# EAGLE design acs (EAGLE 7.2.0)
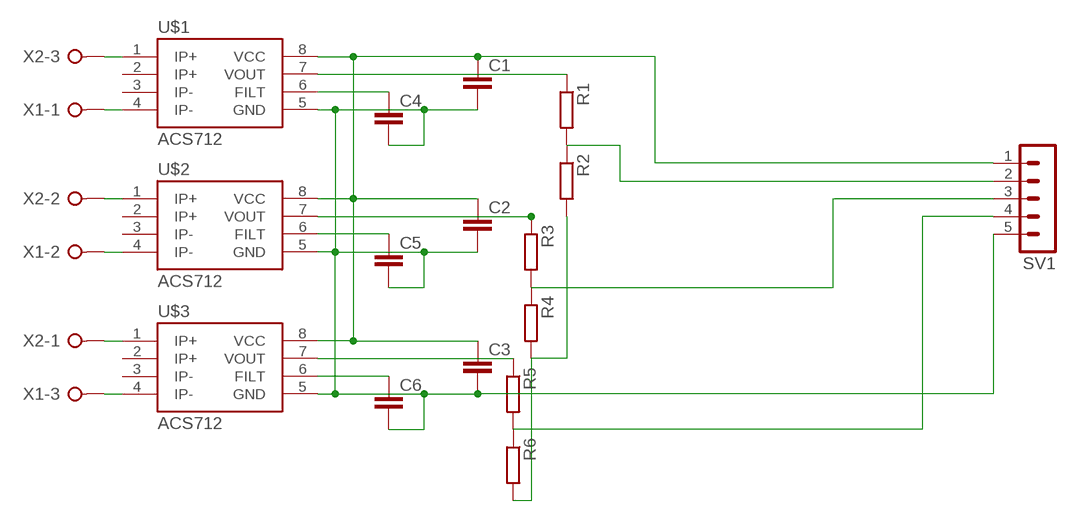
[diagram p0: schematic, sheet 1]

## Parts
C1  C-EUC0603  [C0603]
C2  C-EUC0603  [C0603]
C3  C-EUC0603  [C0603]
C4  C-EUC0603  [C0603]
C5  C-EUC0603  [C0603]
C6  C-EUC0603  [C0603]
R1  R-EU_R0603  [R0603]
R2  R-EU_R0603  [R0603]
R3  R-EU_R0603  [R0603]
R4  R-EU_R0603  [R0603]
R5  R-EU_R0603  [R0603]
R6  R-EU_R0603  [R0603]
SV1  MA05-1  [MA05-1]
U$1  ACS712  [SO08]
U$2  ACS712  [SO08]
U$3  ACS712  [SO08]
X1  W237-03P  [W237-133]
X2  W237-03P  [W237-133]

## Nets
N$1: U$1.4(IP-) X1.1
N$2: U$1.1(IP+) X2.3
N$3: U$2.4(IP-) X1.2
N$4: U$2.1(IP+) X2.2
N$5: U$3.1(IP+) X2.1
N$6: U$3.4(IP-) X1.3
N$7: C1.1 C2.1 C3.1 SV1.1 U$1.8(VCC) U$2.8(VCC) U$3.8(VCC)
N$8: C1.2 C2.2 C3.2 C4.2 C5.2 C6.2 SV1.5 U$1.5(GND) U$2.5(GND) U$3.5(GND)
N$9: C4.1 U$1.6(FILT)
N$10: C5.1 U$2.6(FILT)
N$11: C6.1 U$3.6(FILT)
N$12: R1.2 R2.1 SV1.2
N$13: R1.1 U$1.7(VOUT)
N$14: R3.1 U$2.7(VOUT)
N$15: R5.1 U$3.7(VOUT)
N$16: R3.2 R4.1 SV1.3
N$17: R5.2 R6.1 SV1.4
N$18: R2.2 R4.2 R6.2
Unconnected: U$1.2(IP+) U$1.3(IP-) U$2.2(IP+) U$2.3(IP-) U$3.2(IP+) U$3.3(IP-)

## Library data of the parts
C1-C6 = rcl:C-EU: CAPACITOR, European symbol
R1-R6 = rcl:R-EU_: RESISTOR, European symbol
SV1 = con-lstb:MA05-1: PIN HEADER; OC_FARNELL: unknown; OC_NEWARK: unknown
U$1-U$3 = SparkFun-AnalogIC:ACS712: Hall-effect-based isolated linear current sensor
X1 X2 = con-wago-508:W237-03P: WAGO SREW CLAMP; OC_FARNELL: unknown; OC_NEWARK: unknown

## Board
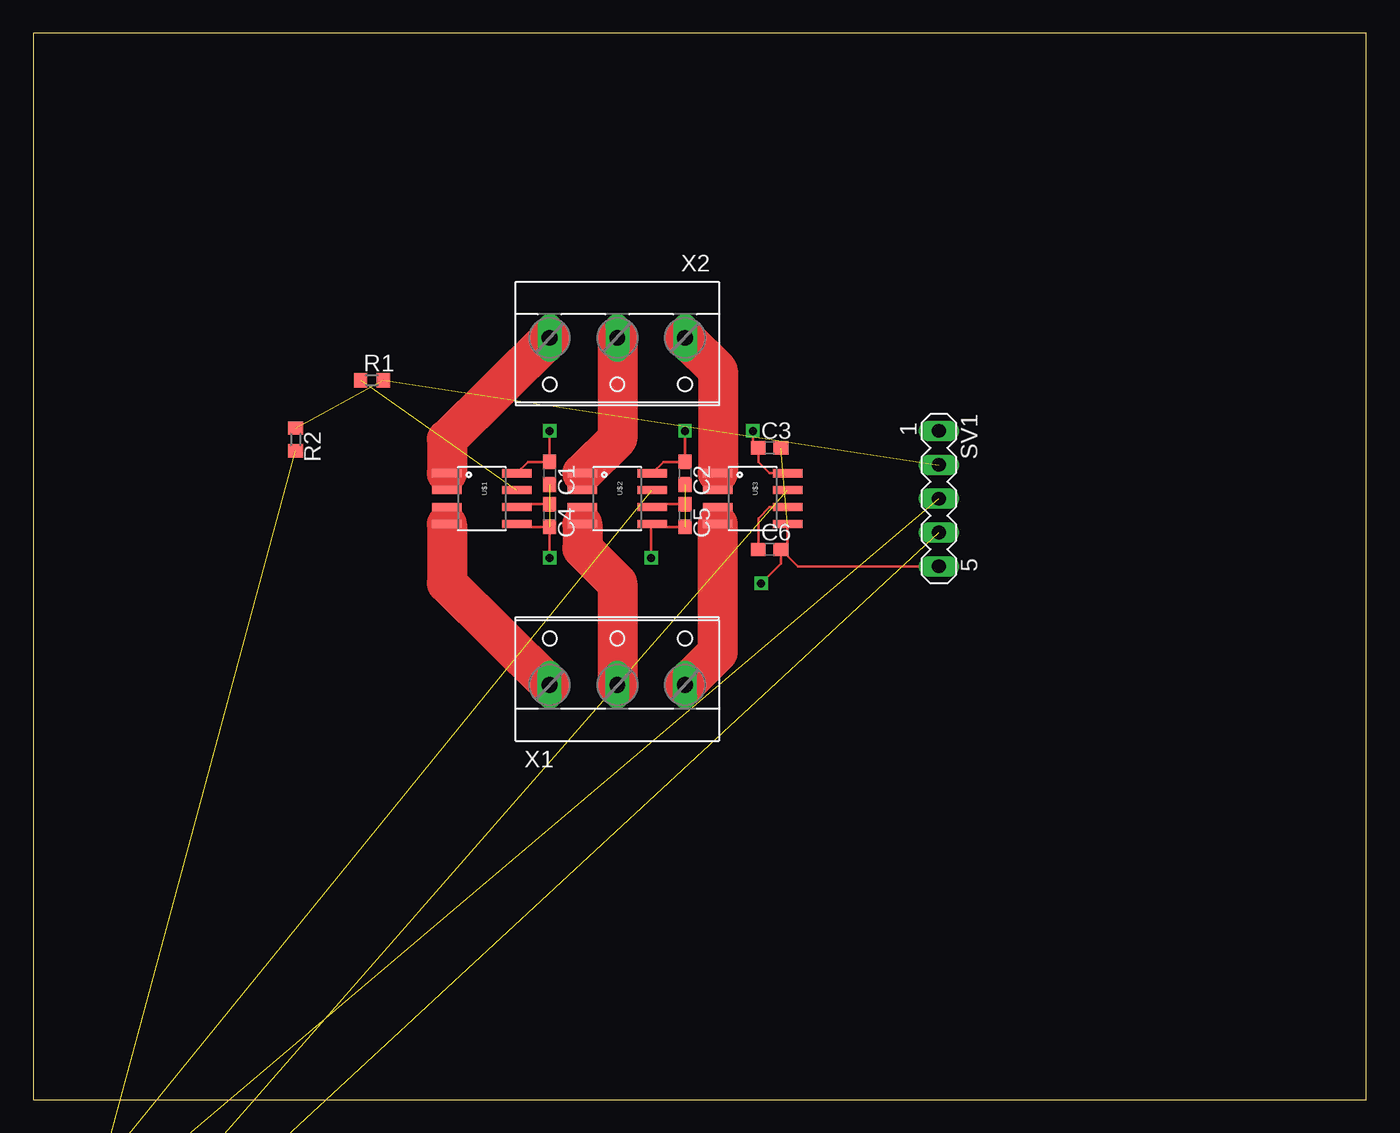
[diagram p1: board, top side]
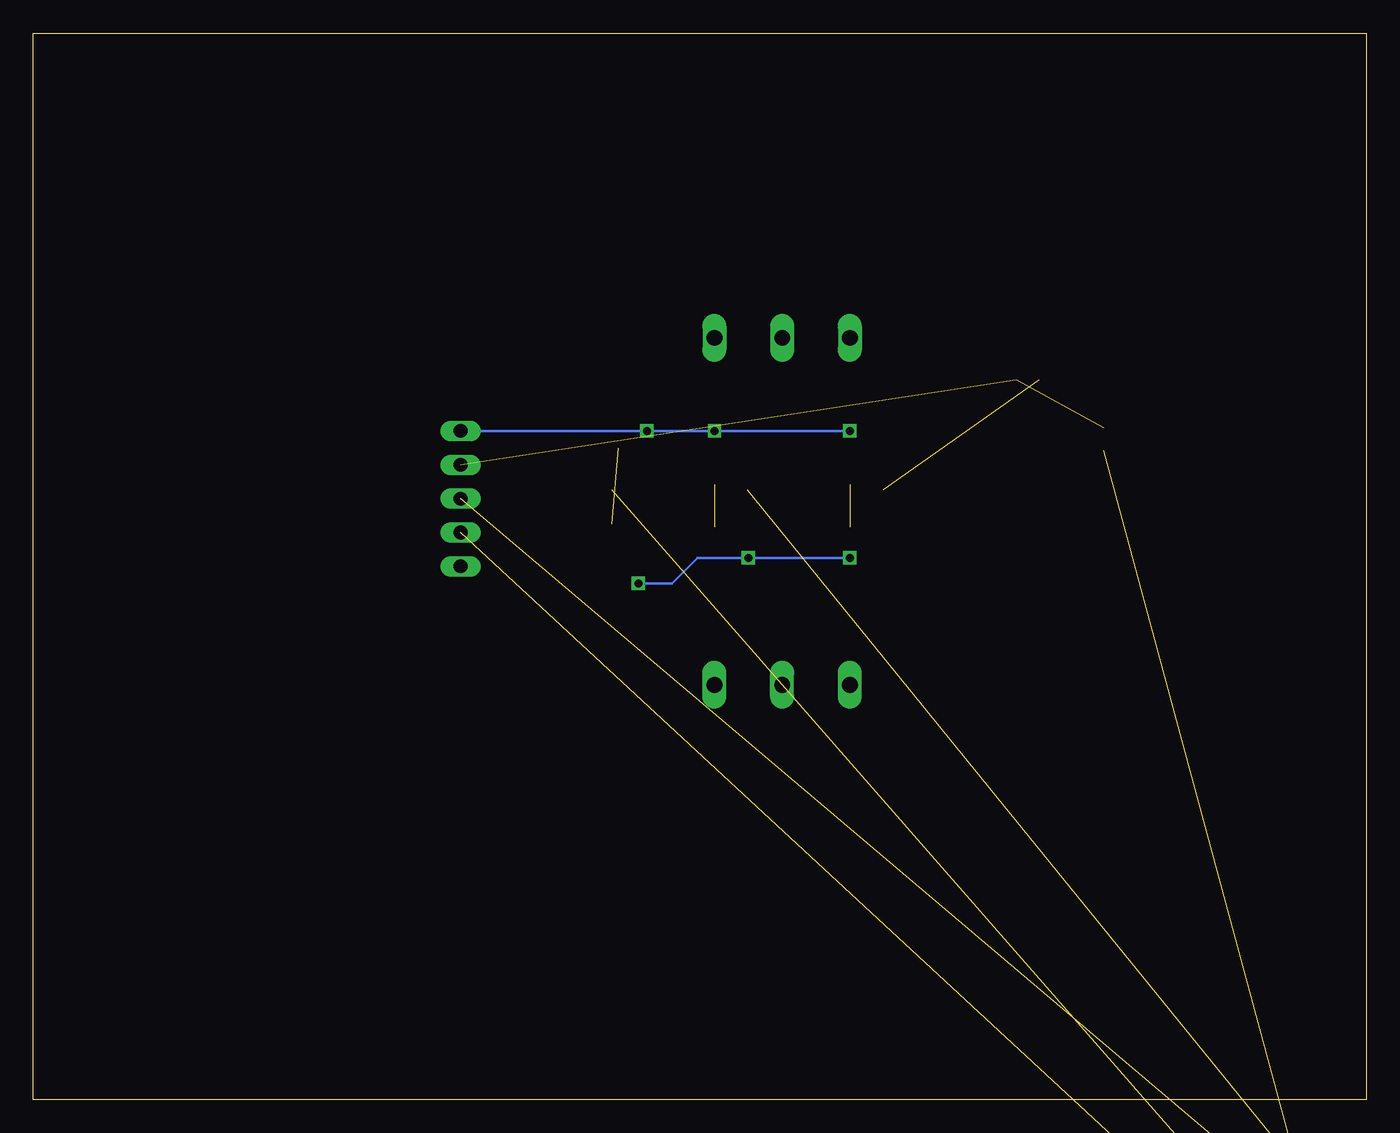
[diagram p2: board, bottom side, seen from below]

Size 100 x 80 mm. Coordinates in mm from the lower left corner, seen from the top.
Outline: 0,0 100,0 100,80 0,80 0,0
Copper layers (1*16): Top 0.035mm / dielectric 1.5mm / Bottom 0.035mm
Design rules "default": minimum track width 10mil, minimum drill 24mil, track to track 8mil, track to pad 8mil, pad to pad 8mil, via to via 8mil, smd to smd 8mil, copper to edge 40mil, drill to drill 8mil, minimum pad ring 10mil, minimum via ring 8mil, stop-mask expansion 4mil, vias tented up to drill 0mil, thermal gap 10mil

### Footprints (pad centres in the part's own frame; a part is rotated, then mirrored left to right if it is on the bottom)
C0603 = smd 1.1 x 1: 1 -0.85,0; 2 0.85,0
R0603 = smd 1 x 1.1: 1 -0.85,0; 2 0.85,0
MA05-1 = drill 1.016 long: 1 -5.08,0; 2 -2.54,0; 3 0,0; 4 2.54,0; 5 5.08,0
SO08 = smd 0.61 x 2.21: 1 -1.905,-2.616; 2 -0.635,-2.616; 3 0.635,-2.616; 4 1.905,-2.616; 5 1.905,2.616; 6 0.635,2.616; 7 -0.635,2.616; 8 -1.905,2.616
W237-133 = drill 1.194 long: 1 -5.08,-0.635; 2 0,-0.635; 3 5.08,-0.635

### Placement (x,y rotation side)
C1  38.73,46.99 270 top
C2  48.9,46.99 270 top
C3  55.24,48.9 0 top
C4  38.73,43.81 270 top
C5  48.9,43.81 270 top
C6  55.24,41.27 0 top
R1  25.4,53.98 0 top
R2  19.68,49.53 270 top
R3  1.91,-10.16 0 top  (outside the outline)
R4  1.91,-13.97 0 top  (outside the outline)
R5  1.91,-17.78 0 top  (outside the outline)
R6  1.91,-21.59 0 top  (outside the outline)
SV1  67.94,45.09 270 top
U$1  33.66,45.09 270 top
U$2  43.81,45.09 270 top
U$3  53.98,45.09 270 top
X1  43.81,31.75 0 top
X2  43.81,56.52 180 top

### Tracks (layer width: path | path; a pad name or v marks a point on that pad's centre or on a via)
N$1
  Top 3: U$1.4 31.04,38.73 X1.1
N$2
  Top 3: X2.3 31.04,49.53 U$1.1
N$3
  Top 3: U$2.4 41.2,41.35 43.81,38.73 X1.2
N$4
  Top 3: X2.2 43.81,49.61 U$2.1
N$5
  Top 3: X2.1 51.36,54.69 U$3.1
N$6
  Top 3: X1.3 51.36,33.58 U$3.4
N$7  (via drill 0.6)
  Top 0.2: U$1.8 37.12,47.84 C1.1 v38.73,50.16 | U$2.8 47.28,47.84 C2.1 v48.9,50.16 | v53.98,50.16 53.98,49.31 C3.1 54.4,47.84 55.24,46.99 U$3.8
  Bottom 0.2: v38.73,50.16 v48.9,50.16 v53.98,50.16 SV1.1
N$8  (via drill 0.6)  (3 unrouted)
  Top 0.2: U$1.5 36.49,42.97 C4.2 v38.73,40.64 | C5.2 46.65,42.97 U$2.5 46.35,43.1 v46.35,40.64 | C6.2 56.59,41.77 U$3.5 | SV1.5 57.37,40.01 C6.2 | C6.2 56.09,40.22 v54.61,38.73
  Bottom 0.2: v38.73,40.64 v46.35,40.64 50.16,40.64 52.07,38.73 v54.61,38.73
N$9
  Top 0.2: U$1.6 36.49,44.66 C4.1
N$10
  Top 0.2: U$2.6 46.65,44.66 C5.1
N$11
  Top 0.2: C6.1 54.4,43.6 55.24,44.45 U$3.6
N$12  (2 unrouted)
N$13  (1 unrouted)
N$14  (1 unrouted)
N$15  (1 unrouted)
N$16  (2 unrouted)
N$17  (2 unrouted)
N$18  (2 unrouted)